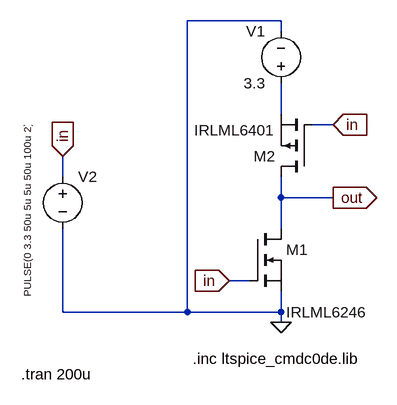
[diagram p0: schematic inverter_raw.asc]
inverter_raw.asc, the LTspice schematic file:
Version 4.1
SHEET 1 880 680
WIRE 192 -176 48 -176
WIRE 192 -160 192 -176
WIRE 192 -32 192 -80
WIRE 272 -16 240 -16
WIRE -144 64 -144 32
WIRE 192 96 192 64
WIRE 272 96 192 96
WIRE 192 144 192 96
WIRE 144 224 112 224
WIRE -144 272 -144 144
WIRE 48 272 48 -176
WIRE 48 272 -144 272
WIRE 192 272 192 240
WIRE 192 272 48 272
WIRE 192 288 192 272
FLAG 192 288 0
FLAG 272 96 out
IOPIN 272 96 Out
FLAG 272 -16 in
IOPIN 272 -16 In
FLAG 112 224 in
IOPIN 112 224 In
FLAG -144 32 in
IOPIN -144 32 In
SYMBOL nmos 144 144 R0
WINDOW 3 56 128 Left 2
SYMATTR Value IRLML6246
SYMATTR InstName M1
SYMBOL pmos 240 64 R180
SYMATTR InstName M2
SYMATTR Value IRLML6401
SYMBOL voltage 192 -64 R180
WINDOW 0 24 96 Left 2
WINDOW 3 24 16 Left 2
WINDOW 123 0 0 Left 0
WINDOW 39 0 0 Left 0
SYMATTR InstName V1
SYMATTR Value 3.3
SYMBOL voltage -144 48 R0
WINDOW 3 -54 201 VLeft 1
WINDOW 123 0 0 Left 0
WINDOW 39 0 0 Left 0
SYMATTR Value PULSE(0 3.3 50u 5u 5u 50u 100u 2)
SYMATTR InstName V2
TEXT 56 344 Left 2 !.inc ltspice_cmdc0de.lib
TEXT -208 368 Left 2 !.tran 200u

The netlist it stands for:
* inverter_raw.asc
M1 out in 0 0 IRLML6246
M2 out in N001 N001 IRLML6401
V1 N001 0 3.3
V2 in 0 PULSE(0 3.3 50u 5u 5u 50u 100u 2)
.model NMOS NMOS
.model PMOS PMOS
.lib standard.mos
.inc ltspice_cmdc0de.lib
.tran 200u
.backanno
.end